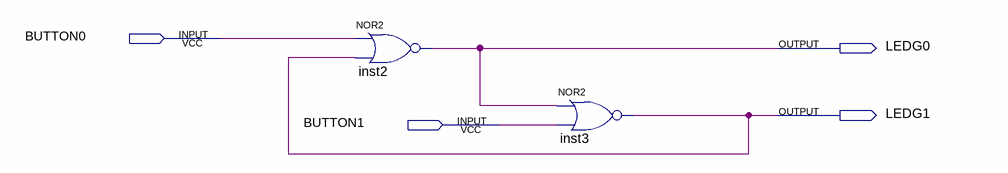
[diagram p0: schematic sheet]
// Quartus schematic rst.bdf as structural Verilog: 2 symbols, 4 pins
module rst (
  input  BUTTON0,
  input  BUTTON1,
  output LEDG0,
  output LEDG1
);

  nor inst2 (LEDG0, BUTTON0, LEDG1);
  nor inst3 (LEDG1, LEDG0, BUTTON1);
endmodule
